# Altium schematic sheet Structure-2.SchDoc
size 420 x 297 mm; Address1: Address1; Address2: Address2; Address3: Address3; Address4: Address4; DocumentNumber: АБВГ.123456.001 Э3; SheetNumber: 1; Scale: 1:1; DocumentType: Схема электрическая принципиальная; FirstReferrence: АБВГ.123456.001
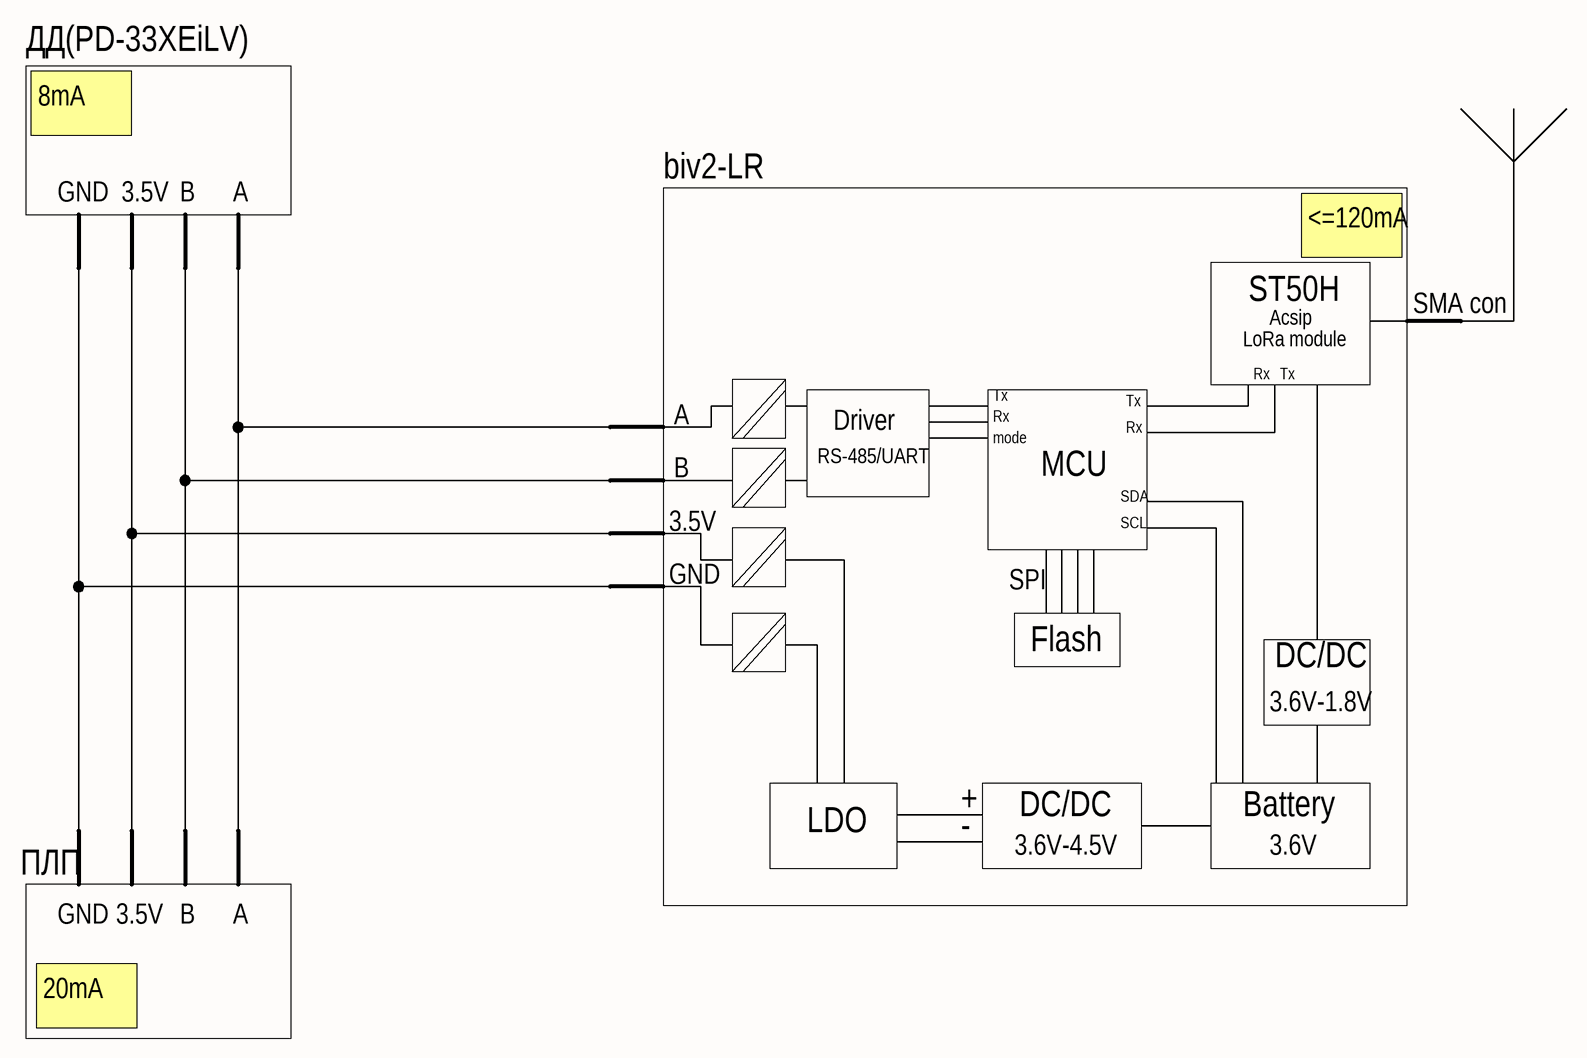
[diagram p0: Structure-2.SchDoc]

## Notes on the sheet
- ДД(PD-33XEiLV)
- 8mA
- biv2-LR
- GND
- 3.5V
- B
- A
- <=120mA
- ST50H
- Acsip
- SMA con
- LoRa module
- Rx
- Tx
- RS-485/UART
- Driver
- mode
- MCU
- SCL
- SDA
- SPI
- Flash
- 3.6V-1.8V
- DC/DC
- LDO
- +
- -
- 3.6V-4.5V
- Battery
- 3.6V
- ПЛП
- 20mA
- Перв. примен.
- Справ. №
- Подп. и дата
- Инв. № дубл.
- Взам. инв. №
- Разраб.
- Изм.
- Лист
- № докум.
- Подп.
- Дата
- Лит.
- Масса
- Масштаб
- Пров.
- Т.контр.
- Листов
- Инв. № подл.
- Утв.
- Н.контр.
- 2.106-A3
- Копировал
- Формат А3